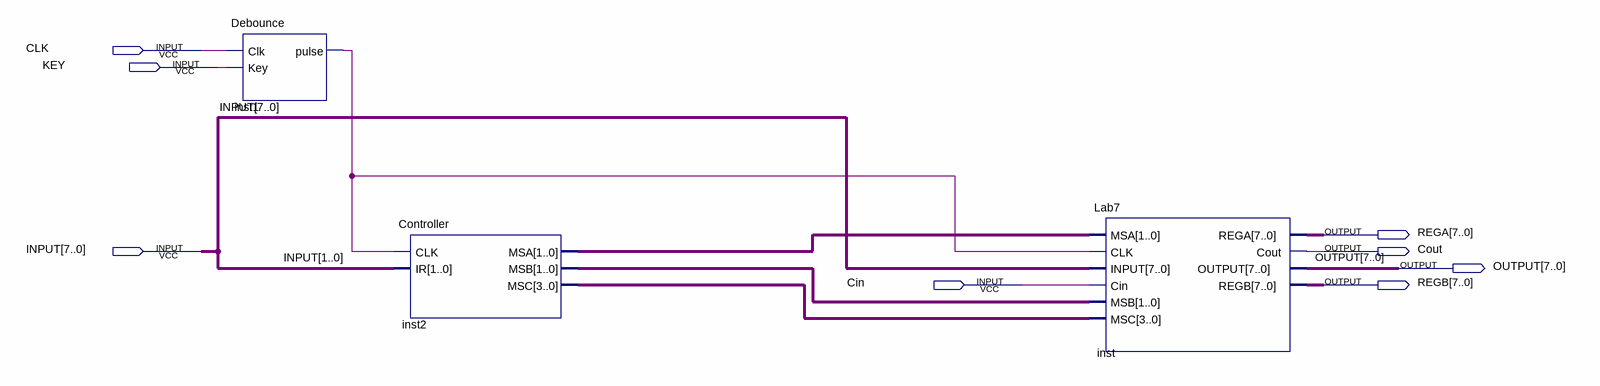
[diagram p0: schematic sheet]
// Quartus schematic Lab8.bdf as structural Verilog: 3 symbols, 8 pins
module Lab8 (
  input  CLK,
  input  KEY,
  input  [7:0] INPUT,
  input  Cin,
  output [7:0] REGA,
  output Cout,
  output [7:0] OUTPUT,
  output [7:0] REGB
);

  wire inst1_pulse;
  wire [1:0] inst2_msa, inst2_msb;
  wire [3:0] inst2_msc;

  Debounce inst1 (.Clk(CLK), .Key(KEY), .pulse(inst1_pulse));
  Controller inst2 (.CLK(inst1_pulse), .IR(INPUT[1:0]), .MSA(inst2_msa), .MSB(inst2_msb), .MSC(inst2_msc));
  Lab7 inst (
    .MSA(inst2_msa), .CLK(inst1_pulse), .INPUT(INPUT), .Cin(Cin), .MSB(inst2_msb), .MSC(inst2_msc),
    .REGA(REGA), .Cout(Cout), .OUTPUT(OUTPUT), .REGB(REGB));
endmodule
